# Altium schematic sheet TinyArduino.SchDoc: EjercicioTinyArduino
size A4; Author: Emilio Calabuig Martínez; Organization: ecm163; Address1: A1; Address2: A2; Address3: A3; Address4: A4; DocumentNumber: 1; Revision: 1.0; SheetNumber: 1; SheetTotal: 1
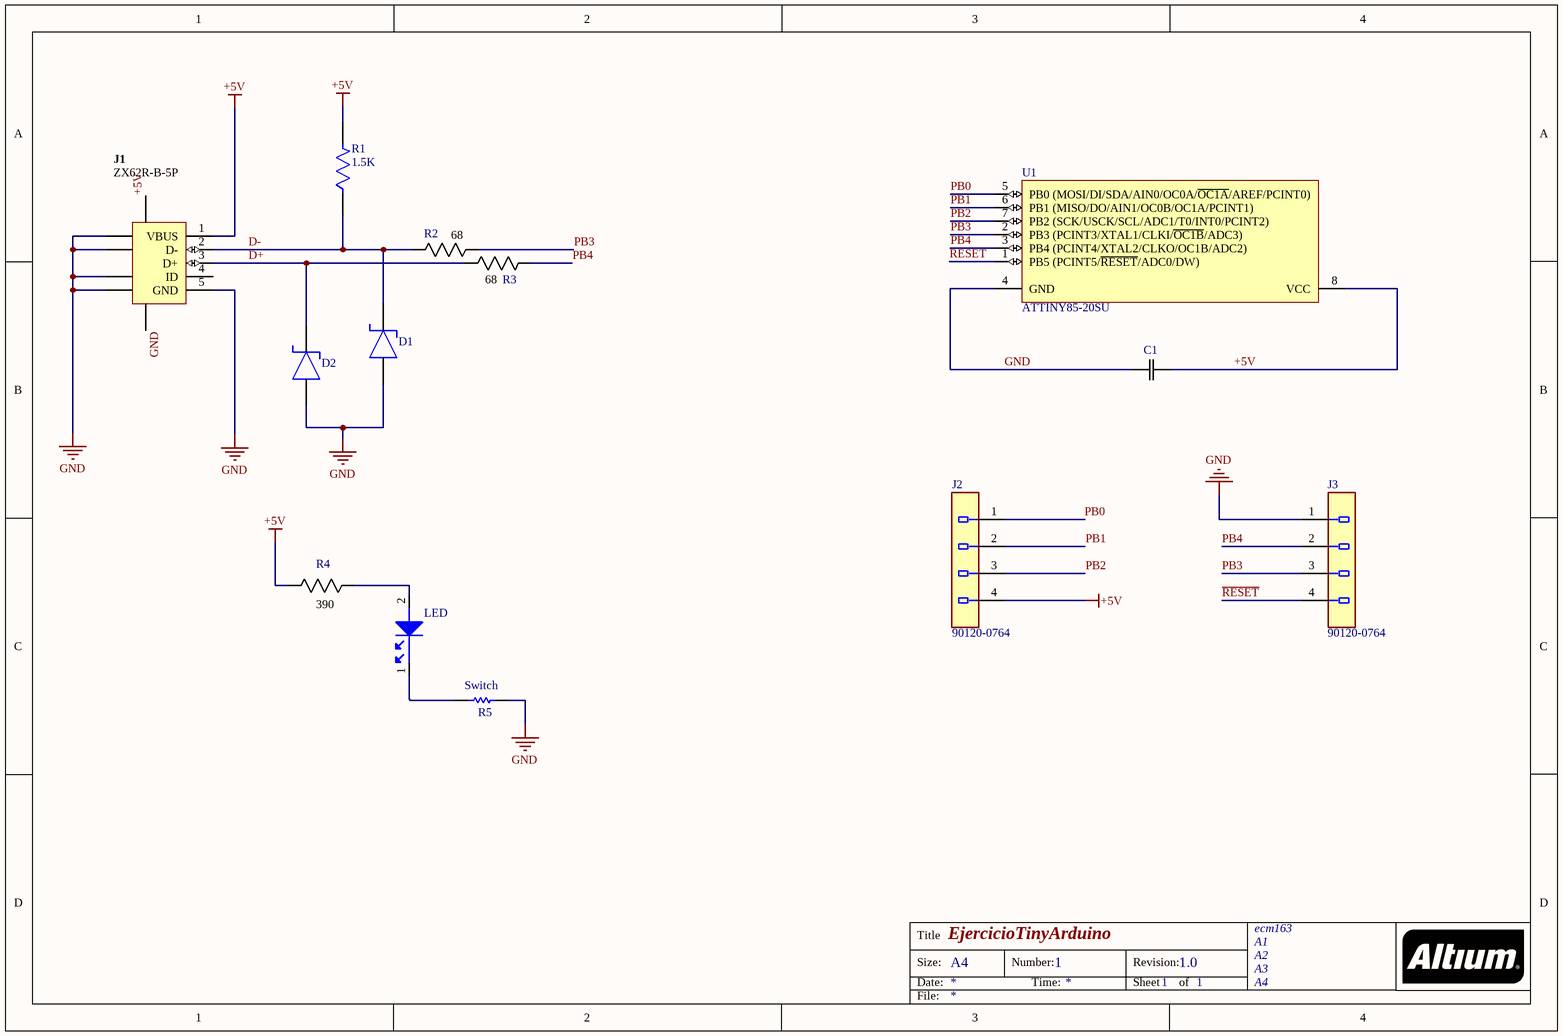
[diagram p0: TinyArduino.SchDoc]

## Parts
C1  0603YC104JAT2A  [CAPC1608X90X35NL15T15]  (value not drawn)
D1  Diodes Inc. B0540WS-7  [PCB-6tqbiewd2diqb4h5r69p-1]  (value not drawn)
D2  Diodes Inc. B0540WS-7  [PCB-6tqbiewd2diqb4h5r69p-1]  (value not drawn)
J1  ZX62R-B-5P  [HIRO-ZX62R-B-5P_V]
J2  Part Number: 90120-0764  [Molex_90120-0764_0]  (hidden comment: Conn_Molex_90120-0764_eec)
J3  Part Number: 90120-0764  [Molex_90120-0764_0]  (hidden comment: Conn_Molex_90120-0764_eec)
LED  LED_AvagoHSMG-C190  [AVAG-HSMX-C190]  (value not drawn)
R1  Resistance: 1.5K  [RESC1609X50X30LL10T20]  (hidden comment: Res_Vishay_CRCW06031K50FKEA_eec)
R2  value 68  [RESC1609X50X30ML10T20]  (hidden comment: CRCW060368R0JNEA)
R3  value 68  [RESC1609X50X30ML10T20]  (hidden comment: CRCW060368R0JNEA)
R4  value 390  [RESC1609X50X30LL10T20]  (hidden comment: CRCW0603390RFKEA)
R5  CRCW06030000Z0EA  [RESC1609X50X30LL10T20]  (value not drawn)
U1  ATTINY85-20SU  [8S2_L]

## Nets
+5V: C1.2 J1.1(VBUS) J1.11(SHLD) J2.4 R1.2 R4.1 U1.8(VCC)
GND: C1.1 D1.2 D2.2 J1.5(GND) J1.6(SHLD) J1.7(SHLD) J1.8(SHLD) J1.9(SHLD) J1.10(SHLD) J3.1 R5.2 U1.4(GND)
~{RESET}: J3.4 U1.1(PB5_(PCINT5/~{RESET}/ADC0/DW))
D+: D2.1 J1.3(D+) R3.2
D-: D1.1 J1.2(D-) R1.1 R2.2
PB0: J2.1 U1.5(PB0_(MOSI/DI/SDA/AIN0/OC0A/~{OC1A}/AREF/PCINT0))
PB1: J2.2 U1.6(PB1_(MISO/DO/AIN1/OC0B/OC1A/PCINT1))
PB2: J2.3 U1.7(PB2_(SCK/USCK/SCL/ADC1/T0/INT0/PCINT2))
PB3: J3.3 R2.1 U1.2(PB3_(PCINT3/XTAL1/CLKI/~{OC1B}/ADC3))
PB4: J3.2 R3.1 U1.3(PB4_(PCINT4/XTAL2/CLKO/OC1B/ADC2))
NetLED_1: LED.1 R5.1
NetLED_2: LED.2 R4.2

Not connected (* = marked no-connect by the designer): J1 4(ID)

## Notes on the sheet
- (near R5) Switch
- Title
- Size:
- Date:
- A4
- Number:
- Time:
- Revision:
- Sheet
- of
- File:

## Library data of the parts
C1 = 0603YC104JAT2A: Imported; Vendor: AVX Corporation; Built_By: EMA_UL_Team; Type: DEV; C: Copyright (C) 2015 Accelerated Designs. All rights reserved; Manufacturer_Part_Number: 0603YC104JAT2A; RefDes: RefDes; Value: Value
D1 D2 = B0540WS-7: DIODE SCHOTTKY 40V 500MA SOD323; Element Configuration: Single; Peak Non-Repetitive Surge Current: 3A; Forward Voltage: 550mV; Peak Reverse Current: 5uA; Polarity: Standard; Capacitance: 125pF; Supplier 1: Digi-Key; Supplier Part Number 1: B0540WSDICT-ND; Manufacturer: Diodes; Manufacturer Part Number: B0540WS-7; Stock 1: 122360; Pricing 1: 1=0.43, 10=0.317, 100=0.1796, 500=0.11896, 1000=0.09121 (USD); Mount: Surface Mount; Number of Pins: 2; Weight: 0.000173oz; Contact Plating: Matte,Tin; Min Operating Temperature: -40°C; Max Operating Temperature: 125°C; Packaging: Tape and Reel; Forward Current: 500mA; Max Repetitive Reverse Voltage (Vrrm): 40V; Package Quantity: 3000; Average Rectified Current: 500mA; Max Forward Surge Current (Ifsm): 3A; Termination: SMD/SMT; Voltage Rating (DC): 40V; Current Rating: 500mA; Output Current: 500mA; Max Reverse Voltage (DC): 40V; Length: 1.8mm; Height: 1mm; Width: 1.4mm; Radiation Hardening: No; REACH SVHC: No SVHC; Lead Free: Lead Free; Category: Productos semiconductores discretos
J1 = ZX62R-B-5P: Connector; USBMicro-B,Reverse type, SMT; 5 Position; Right Angle; ComponentLink1Description: Manufacturer URL; ComponentLink2Description: Datasheet; DatasheetVersion: 08/2010; ComponentLink1URL: http://www.hirose.com/â€Ž; ComponentLink2URL: http://www.hirose.co.jp/cataloge_hp/e24200011.pdf; Operating Temperature: -30 to 85 degC; PartNumber: ZX62R-B-5P; PackageDescription: 5-Pin USB Micro-B R/A Connector; Mounting Technology: Surface Mount; PackageReference: ZX62R-B-5P
J2 J3 = Conn_Molex_90120-0764_eec: CONN 4 Positions Header, Breakaway Connector 0.100" (2.54mm) Through Hole Gold; Manufacturer: Molex; Current - Maximum per Contact: 3.0A; Number of Positions: 4; Contact Length - Post: 2.90mm; Contact Length - Mating: 6.75mm; Voltage - Maximum: 350V; helpURL: https://upverter.com/upn/revision/abd89bfd3815e4cd/; ComponentLink2Description: Datasheet; Temperature: -55°C to +125°C; Package: HDR4; Supplier 2: Mouser; Supplier 1: Digi-Key; ComponentLink1URL: https://upverter.com/upn/revision/abd89bfd3815e4cd/; Supplier Part Number 2: 538-90120-0764; Supplier Part Number 1: WM8086-ND; ComponentLink1Description: Upverter; ComponentLink2URL: http://www.molex.com/pdm_docs/sd/901200764_sd.pdf; RoHS: TRUE; Mouser Part Number: 538-90120-0764; Temperature Range High: +125°C; Digikey Description: CONN 4 Positions Header, Breakaway Connector 0.100" (2.54mm) Through Hole Gold; Digikey Part Number: WM8086-ND; Insulation Height: 2.50mm; Lead Free: yes; Temperature Range Low: -55°C; Pitch: 2.54mm
R1 = Res_Vishay_CRCW06031K50FKEA_eec: RES 1.5k Ohm ±1% 0.1W, 1/10W Chip Resistor 0603 (1608 Metric) Automotive AEC-Q200 Thick Film; Manufacturer: Vishay; Voltage: 75V; Temperature Coefficient: ±100ppm/°C; Power: 100mW; Part Number: CRCW06031K50FKEA; helpURL: https://upverter.com/upn/revision/92de3c491728bf4e/; ComponentLink2Description: Datasheet; Temperature: -55°C to +155°C; Package: 0603 (1608 metric); Supplier 2: Mouser; Price: 0.0140695309128; Supplier 1: Digi-Key; ComponentLink1URL: https://upverter.com/upn/revision/92de3c491728bf4e/; Supplier Part Number 2: 71-CRCW0603-1.5K-E3; Supplier Part Number 1: 541-1.50KHCT-ND; Value: 1.5K; ComponentLink1Description: Upverter; ComponentLink2URL: http://www.vishay.com/docs/20035/dcrcwe3.pdf; RoHS: TRUE; Mouser Part Number: 71-CRCW0603-1.5K-E3; Ipc Land Pattern Name: RESC16080X45; Tolerance: ±1%; Temperature Range High: +155°C; Digikey Description: RES 1.5k Ohm ±1% 0.1W, 1/10W Chip Resistor 0603 (1608 Metric) Automotive AEC-Q200 Thick Film; Digikey Part Number: 541-1.50KHCT-ND; Lead Free: yes; Temperature Range Low: -55°C
R2 R3 = CRCW060368R0JNEA: RES SMD 68 OHM 5% 1/10W 0603; Built_By: EMA_UL_Team; C: Copyright (C) 2015 Accelerated Designs. All rights reserved; Vendor: Vishay; Manufacturer_Part_Number: CRCW060368R0JNEA; RefDes: RefDes; Type: DEV
R4 = CRCW0603390RFKEA: Imported; Manufacturer_Part_Number: CRCW0603390RFKEAHP; Vendor: Vishay; Built_By: EMA_UL_Team; C: Copyright (C) 2015 Accelerated Designs. All rights reserved; RefDes: RefDes; Type: DEV
R5 = CRCW06030000Z0EA: 0Ω 1%; ComponentLink1Description: Datasheet; PartNumber: CRCW06030000Z0EA; ComponentLink1URL: http://www.vishay.com/docs/20035/dcrcwe3.pdf; PackageReference: 0603
U1 = ATTINY85-20SU: 8-bit AVR Microcontroller, 20MHz, 2.7-5.5V, 8K Flash, 512 Bytes EEPROM, 512 Bytes SRAM, Industrial Grade (-40°C to 85°C), 8-Lead SOIC, Pb-Free; ComponentLink1Description: Manufacturer URL; ComponentLink2Description: ATtiny25/45/85 Datasheet; ComponentLink3Description: ATtiny25/45/85 Summary; ComponentLink3URL: http://www.atmel.com/dyn/resources/prod_documents/2586S.pdf; DatasheetVersion: revN, Apr-2011; ComponentLink1URL: http://www.atmel.com/; RevisionNote: DatasheetVersion updated. URLs added.; PackageVersion: revF, Apr-2008; PackageDescription: 8-Lead, 0.208" Body, Plastic Small Outline Package (EIAJ); ComponentLink2URL: http://www.atmel.com/dyn/resources/prod_documents/doc2586.pdf; PackageReference: 8S2; PartNumber: ATTINY85-20SU